# Altium schematic sheet Template.SchDoc
size A4
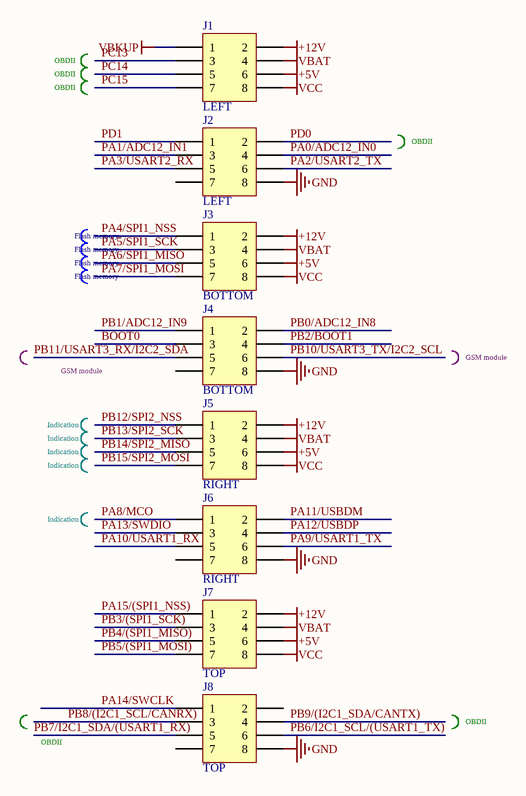
[diagram p0: Template.SchDoc]

## Parts
J1  LEFT  [PBDM-8]
J2  LEFT  [PBDM-8]
J3  BOTTOM  [PBDM-8]
J4  BOTTOM  [PBDM-8]
J5  RIGHT  [PBDM-8]
J6  RIGHT  [PBDM-8]
J7  TOP  [PBDM-8]
J8  TOP  [PBDM-8]

## Nets
+5V: J1.6 J3.6 J5.6 J7.6
+12V: J1.2 J3.2 J5.2 J7.2
GND: J2.8 J4.8 J6.8 J8.8
VBAT: J1.4 J3.4 J5.4 J7.4
VBKUP: J1.1
VCC: J1.8 J3.8 J5.8 J7.8
BOOT0: J4.3
PA0/ADC12_IN0: J2.4
PA1/ADC12_IN1: J2.3
PA2/USART2_TX: J2.6
PA3/USART2_RX: J2.5
PA4/SPI1_NSS: J3.1
PA5/SPI1_SCK: J3.3
PA6/SPI1_MISO: J3.5
PA7/SPI1_MOSI: J3.7
PA8/MCO: J6.1
PA9/USART1_TX: J6.6
PA10/USART1_RX: J6.5
PA11/USBDM: J6.2
PA12/USBDP: J6.4
PA13/SWDIO: J6.3
PA14/SWCLK: J8.1
PA15/(SPI1_NSS): J7.1
PB0/ADC12_IN8: J4.2
PB1/ADC12_IN9: J4.1
PB2/BOOT1: J4.4
PB3/(SPI1_SCK): J7.3
PB4/(SPI1_MISO): J7.5
PB5/(SPI1_MOSI): J7.7
PB6/I2C1_SCL/(USART1_TX): J8.6
PB7/I2C1_SDA/(USART1_RX): J8.5
PB8/(I2C1_SCL/CANRX): J8.3
PB9/(I2C1_SDA/CANTX): J8.4
PB10/USART3_TX/I2C2_SCL: J4.6
PB11/USART3_RX/I2C2_SDA: J4.5
PB12/SPI2_NSS: J5.1
PB13/SPI2_SCK: J5.3
PB14/SPI2_MISO: J5.5
PB15/SPI2_MOSI: J5.7
PC13: J1.3
PC14: J1.5
PC15: J1.7
PD0: J2.2
PD1: J2.1

Not connected (* = marked no-connect by the designer): J2 7; J4 7; J6 7; J8 2 7

## Notes on the sheet
- OBDII
- Flash memory
- GSM module
- Indication

## Library data of the parts
J1-J8 = PBDM-8: 2x4-pin header, pitch 2.54 mm; PartNumber: PBDM-8; Category: Connector; ComponentLink1Description: Datasheet; ComponentLink1URL: d:\_AltiumLibs\Pdf\Mechanical\Connector\pbsm.pdf; Author: oiezhov